# Altium project Carrier-Board-v1.0.PrjPcb (part 3 of 15)

## Sheet LINEAR_VOLTAGE_REG.SchDoc
size A4; SheetNumber: 5; SheetTotal: 27
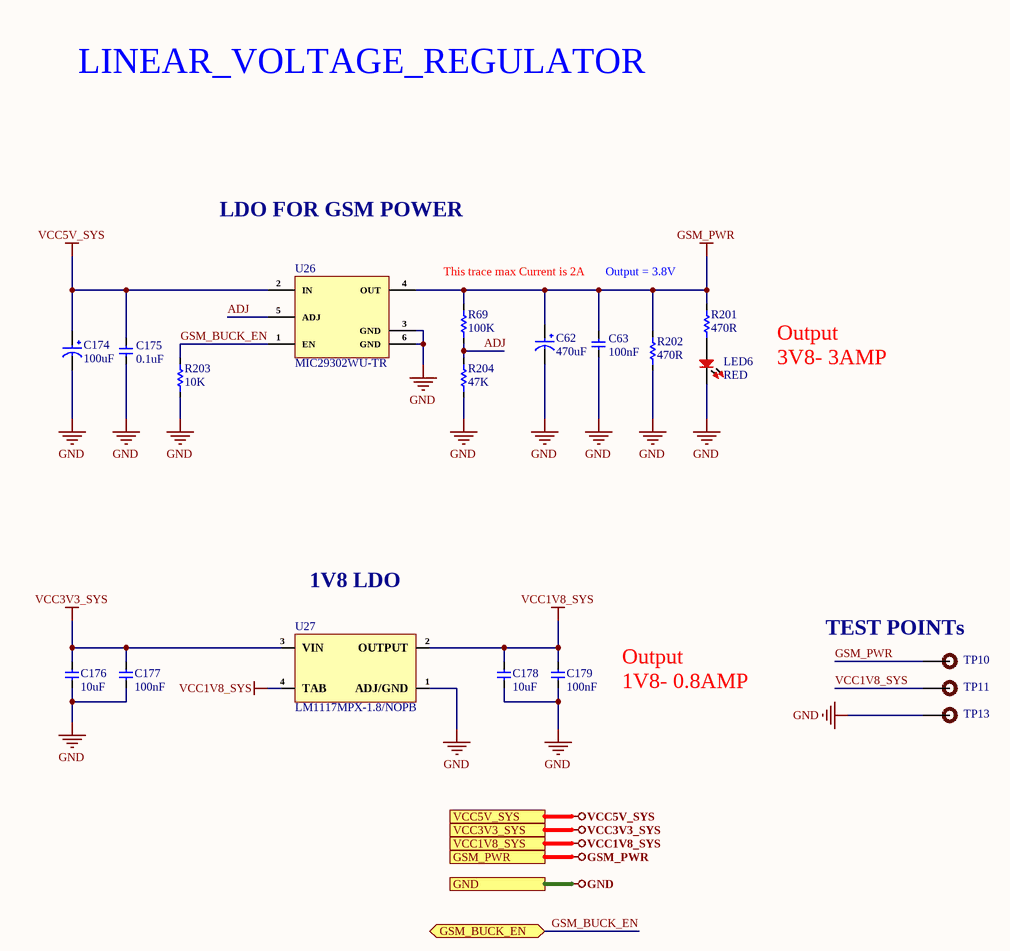
[diagram p4: LINEAR_VOLTAGE_REG.SchDoc]

### Parts
C62  470uF  [Case-E]
C63  100nF  [Cap-0603]
C174  100uF  [Case-B]
C175  0.1uF  [Cap-0603]
C176  10uF  [Cap-0805]
C177  100nF  [cap-0402]
C178  10uF  [Cap-0805]
C179  100nF  [cap-0402]
LED6  RED  [LED-0603]
R69  100K  [Res-0402]
R201  470R  [Res-0603]
R202  470R  [Res-0603]
R203  10K  [Res-0402]
R204  47K  [Res-0402]
TP10  TEST POINT 0.5mm Dia  [Test-point - 0.5mm]  (value not drawn)  (no BOM)
TP11  TEST POINT 0.5mm Dia  [Test-point - 0.5mm]  (value not drawn)  (no BOM)
TP13  TEST POINT 0.5mm Dia  [Test-point - 0.5mm]  (value not drawn)  (no BOM)
U26  MIC29302WU-TR  [TO-263-5 (D2PAK)]
U27  LM1117MPX-1.8/NOPB  [SOT- 223]

### Ports
GND (see POWER SECTION[3B], AUDIO_INTERFACE[1D], BUCK REGULATOR[3D], DEBUG_UART_INTERFACE[3D], DIGITAL IO_RELAY_SHEET[5D], DUAL_SIM_INTERFACE[3D], ETHERNET_PHY0[4D], ETHERNET_PHY1[4D], GSM_INTERFACE[2D], HDMI_INTERFACE[3D], INPUT_PROTECTION[3D], MICRO_SD_INTERFACE[3D], MIPI-DSI DISPLAY[3D], POWER SECTION[3D], PUSH BUTTONs_INTERFACE[3C], RGB_LEDs_INTERFACE[3D], ROCKCHIP_PWR_SUPPLY[1D], ROCKCHIP_SYSTEM_CONTROL[3C], RS232_RS485_INTERFACE[3C], SENSOR_SHEET[3D], USB2.0_INTERFACE[3D], USB3.0_INTERFACE[3D], USB-C_INTERFACE[2D], WIEGAND_INTERFACE[3D], WIFI_BLUETOOTH_SHEET[4C]), GSM_BUCK_EN (bidir, see POWER SECTION[3B], POWER SECTION[3D], ROCKCHIP_GPIO_NC PINS[3D]), GSM_PWR (see POWER SECTION[3B], GSM_INTERFACE[2D], POWER SECTION[3D]), VCC1V8_SYS (see POWER SECTION[3B], ETHERNET_PHY0[4D], ETHERNET_PHY1[4D], POWER SECTION[3D], ROCKCHIP_PWR_SUPPLY[1D], WIFI_BLUETOOTH_SHEET[4C]), VCC3V3_SYS (see POWER SECTION[3B], AUDIO_INTERFACE[1D], BUCK REGULATOR[3D], DEBUG_UART_INTERFACE[3D], DIGITAL IO_RELAY_SHEET[5D], ETHERNET_PHY0[4D], ETHERNET_PHY1[4D], GSM_INTERFACE[2D], HDMI_INTERFACE[3D], MIPI-DSI DISPLAY[3D], POWER SECTION[3D], PUSH BUTTONs_INTERFACE[3C], ROCKCHIP_PWR_SUPPLY[1D], ROCKCHIP_SYSTEM_CONTROL[3C], RS232_RS485_INTERFACE[3C], SENSOR_SHEET[3D], USB-C_INTERFACE[2D], WIEGAND_INTERFACE[3D], WIFI_BLUETOOTH_SHEET[4C]), VCC5V_SYS (see POWER SECTION[3B], BUCK REGULATOR[3D], DIGITAL IO_RELAY_SHEET[5D], HDMI_INTERFACE[3D], MIPI-DSI DISPLAY[3D], POWER SECTION[3D], RGB_LEDs_INTERFACE[3D], ROCKCHIP_PWR_SUPPLY[1D], USB2.0_INTERFACE[3D], USB3.0_INTERFACE[3D], USB-C_INTERFACE[2D], WIEGAND_INTERFACE[3D])

### Nets
GND: C62.2 C63.1 C174.2 C175.1 C176.1 C177.1 C178.1 C179.1 LED6.2 R202.1 R203.1 R204.1 TP13.1 U26.3(GND) U26.6(GND) U27.1(ADJ/GND) ; port GND
GSM_PWR: C62.1 C63.2 R69.2 R201.2 R202.2 TP10.1 U26.4(OUT) ; port GSM_PWR
VCC1V8_SYS: C178.2 C179.2 TP11.1 U27.2(OUTPUT) U27.4(TAB) ; port VCC1V8_SYS
VCC3V3_SYS: C176.2 C177.2 U27.3(VIN) ; port VCC3V3_SYS
VCC5V_SYS: C174.1 C175.2 U26.2(IN) ; port VCC5V_SYS
ADJ: R69.1 R204.2 U26.5(ADJ)
GSM_BUCK_EN: R203.2 U26.1(EN) ; port GSM_BUCK_EN
NetLED6_1: LED6.1 R201.1

### Notes on the sheet
- LINEAR_VOLTAGE_REGULATOR
- LDO FOR GSM POWER
- (near R69) This trace max Current is 2A
- Output = 3.8V
- 3V8- 3AMP
- Output
- 1V8 LDO
- (near TP10) TEST POINTs
- 1V8- 0.8AMP
- File:
- Title:
- Date:
- Page
- Num:
- Total:
- Drawn By: Huzaifa Ali

### Library data of the parts
C62 = TAJE477K010RNJ: CAP TANT 470UF 10% 10V 2917; Manufacturer: Kyocera AVX; Dielectric Material: Tantalum; ESR (Equivalent Series Resistance): 500mR; Leakage Current: 47uA; Polarity: Polar; Item Type: Capacitor; Supplier 1: Arrow Electronics; Manufacturer Part Number: TAJE477K010RNJ; RoHS: Yes; Category: Tantalum Capacitors; Stock 1: 5; Pricing 1: 1=1.3181 (USD); Mounting Technology: Surface Mount,PCB; Case/Package: 2917; Pins: 2; Case Code (Imperial): 2917; Case Code (Metric): 7343; Min Operating Temperature: -55°C; Max Operating Temperature: 125°C; Value: 470uF; Tolerance: 10%; Packaging: Tape and Reel; Voltage Rating: 10V; Voltage Rating (DC): 10V; Package Quantity: 400; Termination: SMD/SMT; Voltage: 10V; Dissipation Factor: 10%; Features: General Purpose; Series: TAJ; Construction: Flat; Length: 7.3mm; Width: 4.3mm; Height: 4.1mm; Depth: 4.3mm; Lead Pitch: 4.4mm; Radiation Hardening: No; Reach SVHC Compliant: No; Lead Free: Lead Free; RoHS Compliant: Yes; ComponentLink1URL: https://datasheet.ciiva.com/7832/taj-7832508.pdf?src-supplier=Element14; ComponentLink1Description: https://datasheet.ciiva.com/7832/taj-7832508.pdf?src-supplier=Element14; ComponentLink2URL: https://datasheet.ciiva.com/7832/taj-7832507.pdf?src-supplier=Element14; ComponentLink2Description: https://datasheet.ciiva.com/7832/taj-7832507.pdf?src-supplier=Element14; ComponentLink3URL: https://datasheet.ciiva.com/265/taj-265547.pdf?src-supplier=Digi-Key; ComponentLink3Description: https://datasheet.ciiva.com/265/taj-265547.pdf?src-supplier=Digi-Key; ComponentLink4URL: https://datasheet.ciiva.com/265/taj-265546.pdf?src-supplier=Digi-Key; ComponentLink4Description: https://datasheet.ciiva.com/265/taj-265546.pdf?src-supplier=Digi-Key; ComponentLink5URL: https://datasheet.ciiva.com/265/taj-265548.pdf?src-supplier=Digi-Key; ComponentLink5Description: https://datasheet.ciiva.com/265/taj-265548.pdf?src-supplier=Digi-Key; ComponentLink6URL: https://datasheet.ciiva.com/12882/taj-27497-12882504.pdf?src-supplier=Mouser; ComponentLink6Description: https://datasheet.ciiva.com/12882/taj-27497-12882504.pdf?src-supplier=Mouser; ComponentLink7URL: https://datasheet.ciiva.com/14602/70001050-14602312.pdf?src-supplier=Allied+Electronics; ComponentLink7Description: https://datasheet.ciiva.com/14602/70001050-14602312.pdf?src-supplier=Allied+Electronics; ComponentLink8URL: https://datasheet.ciiva.com/14600/70001050-14600301.pdf?src-supplier=Allied+Electronics; ComponentLink8Description: https://datasheet.ciiva.com/14600/70001050-14600301.pdf?src-supplier=Allied+Electronics; ComponentLink9URL: https://datasheet.ciiva.com/11229/taj-11229470.pdf?src-supplier=Avnet; ComponentLink9Description: https://datasheet.ciiva.com/11229/taj-11229470.pdf?src-supplier=Avnet; ComponentLink10URL: https://datasheet.ciiva.com/16330/taj-16330918.pdf?src-supplier=Future+Electronics; ComponentLink10Description: https://datasheet.ciiva.com/16330/taj-16330918.pdf?src-supplier=Future+Electronics; Supplier Part Number 1: TAJE477K010RNJ; LCSC Part Number: C7234
C63 = CC0603KRX5R9BB104: CAP CER 0.1UF 50V X5R 0603; Manufacturer: Yageo; Tolerance: 10%; Item Type: Capacitor; Supplier 1: Digi-Key; Manufacturer Part Number: CC0603KRX5R9BB104; RoHS: Yes; Category: Ceramic Capacitors; Stock 1: 152253; Pricing 1: 1=0.10000, 10=0.05200, 50=0.02820, 100=0.02310, 500=0.01648, 1000=0.01294 (USD); Mount: Surface Mount; Case/Package: 0603; Case Code (Metric): 1608; Case Code (Imperial): 0603; Weight: 7.1E-05oz; Min Operating Temperature: -55°C; Max Operating Temperature: 85°C; Capacitance: 100nF; Packaging: Tape and Reel; Voltage Rating: 50V; Dielectric: X5R; Termination: SMD/SMT; Voltage Rating (DC): 50V; Package Quantity: 4000; Length: 0.063inch; Width: 0.031inch; Thickness: 0.035inch; Lead Free: Lead Free; ComponentLink1URL: http://www.mouser.com/ds/2/447/Yageo_UPY-GP_NP0_16V-to-50V_9-358835.pdf?src-supplier=Mouser; ComponentLink1Description: http://www.mouser.com/ds/2/447/Yageo_UPY-GP_NP0_16V-to-50V_9-358835.pdf?src-supplier=Mouser; ComponentLink2URL: https://www.yageo.com/upload/media/product/productsearch/datasheet/mlcc/UPY-GPHC_X5R_4V-to-50V_26.pdf?src-supplier=Digi-Key; ComponentLink2Description: https://www.yageo.com/upload/media/product/productsearch/datasheet/mlcc/UPY-GPHC_X5R_4V-to-50V_26.pdf?src-supplier=Digi-Key; ComponentLink3URL: http://www.yageo.com/exep/pages/download/literatures/ProductSelectionGuide%202014_Final_2.pdf?src-supplier=Digi-Key; ComponentLink3Description: http://www.yageo.com/exep/pages/download/literatures/ProductSelectionGuide%202014_Final_2.pdf?src-supplier=Digi-Key; Supplier Part Number 1: 311-4046-1-ND; LCSC Part Number: C110022; Halogen Free: Halogen Free
C174 = TAJB107M010RNJ: CAP TANT 100UF 20% 10V 1411; Manufacturer: Kyocera AVX; Dielectric Material: Tantalum; Tolerance: 10%; ESR (Equivalent Series Resistance): 1.4R; Leakage Current: 10uA; Dissipation Factor: 8%; Item Type: Capacitor; Supplier 1: Rs; Manufacturer Part Number: TAJB107M010RNJ; RoHS: Yes; Category: Tantalum Capacitors; Stock 1: 17520; Pricing 1: 2000=0.302 (GBP); Mounting Technology: Surface Mount; Case/Package: 1210; Case Code (Imperial): 1210; Case Code (Metric): 3528; Min Operating Temperature: -55°C; Max Operating Temperature: 125°C; Value: 100uF; Voltage Rating (DC): 10V; Series: TAJ; Construction: Flat; Voltage Rating: 10V; Package Quantity: 2000; Packaging: Tape and Reel; Termination: SMD/SMT; Voltage: 10V; Features: General Purpose; Length: 3.5mm; Width: 2.8mm; Height: 2.1mm; Depth: 2.8mm; Radiation Hardening: No; Lead Free: Lead Free; RoHS Compliant: Yes; Reach SVHC Compliant: No; ComponentLink1URL: https://datasheet.ciiva.com/264/taj-264281.pdf?src-supplier=Digi-Key; ComponentLink1Description: https://datasheet.ciiva.com/264/taj-264281.pdf?src-supplier=Digi-Key; ComponentLink2URL: https://datasheet.ciiva.com/264/taj-264280.pdf?src-supplier=Digi-Key; ComponentLink2Description: https://datasheet.ciiva.com/264/taj-264280.pdf?src-supplier=Digi-Key; ComponentLink3URL: https://datasheet.ciiva.com/264/taj-264282.pdf?src-supplier=Digi-Key; ComponentLink3Description: https://datasheet.ciiva.com/264/taj-264282.pdf?src-supplier=Digi-Key; ComponentLink4URL: https://datasheet.ciiva.com/11225/taj-11225964.pdf?src-supplier=Avnet; ComponentLink4Description: https://datasheet.ciiva.com/11225/taj-11225964.pdf?src-supplier=Avnet; ComponentLink5URL: https://datasheet.ciiva.com/11225/taj-11225963.pdf?src-supplier=Avnet; ComponentLink5Description: https://datasheet.ciiva.com/11225/taj-11225963.pdf?src-supplier=Avnet; Supplier Part Number 1: 1354069; LCSC Part Number: C7196
C175 = CC0603KRX7R0BB104: CAP CER 0.1UF 100V X7R 0603; Manufacturer: Yageo; Capacitance: 100nF; Tolerance: 10%; Item Type: Capacitor; Supplier 1: Digi-Key; Manufacturer Part Number: CC0603KRX7R0BB104; RoHS: Yes; Category: Ceramic Capacitors; Stock 1: 60476; Pricing 1: 1=0.19000, 10=0.13500, 50=0.07680, 100=0.06370, 500=0.04466, 1000=0.03696 (USD); Mount: Surface Mount; Case/Package: 0603; Case Code (Metric): 1608; Case Code (Imperial): 0603; Weight: 7.1E-05oz; Min Operating Temperature: -55°C; Max Operating Temperature: 125°C; Package Quantity: 4000; Voltage Rating: 100V; Packaging: Tape and Reel; Dielectric: X7R; Termination: SMD/SMT; Resistor Type: Ceramic; Voltage Rating (DC): 100V; Series: CC; Length: 0.063inch; Width: 0.031inch; Thickness: 0.035inch; Depth: 0.8mm; Lead Free: Lead Free; RoHS Compliant: Yes; ComponentLink1URL: https://datasheet.ciiva.com/6277/mlccorderingcode-6277030.pdf?src-supplier=Digi-Key; ComponentLink1Description: https://datasheet.ciiva.com/6277/mlccorderingcode-6277030.pdf?src-supplier=Digi-Key; ComponentLink2URL: https://datasheet.ciiva.com/6277/mlccorderingcode-6277081.pdf?src-supplier=Digi-Key; ComponentLink2Description: https://datasheet.ciiva.com/6277/mlccorderingcode-6277081.pdf?src-supplier=Digi-Key; ComponentLink3URL: https://datasheet.ciiva.com/6277/mlccorderingcode-6277082.pdf?src-supplier=Digi-Key; ComponentLink3Description: https://datasheet.ciiva.com/6277/mlccorderingcode-6277082.pdf?src-supplier=Digi-Key; Supplier Part Number 1: 311-1523-1-ND; LCSC Part Number: C113803
C176 C178 = GRM21BR61H106ME43L: CAP CER 10UF 50V X5R 0805; Manufacturer: Murata; Supplier 1: Digi-Key; Manufacturer Part Number: GRM21BR61H106ME43L; RoHS: Yes; Category: Ceramic Capacitors; Stock 1: 26; Pricing 1: 1=0.44000, 10=0.30700, 50=0.21500, 100=0.18420, 500=0.13818, 1000=0.11668 (USD); Supplier Part Number 1: 490-18664-1-ND; LCSC Part Number: C2190942
C177 C179 = C1005X7R1H104KT000F: CAP CER 0.1UF 50V X7R 0402; Manufacturer: TDK; Tolerance: 10%; Voltage: 25V; Item Type: Capacitor; Supplier 1: Avnet; Manufacturer Part Number: C1005X7R1H104KT000F; RoHS: No; Category: Ceramic Capacitors; Dielectric: X7R; Supplier Part Number 1: C1005X7R1H104KT000F; LCSC Part Number: C361198; ComponentLink1Description: LCSC; ComponentLink1URL: https://www.lcsc.com/product-detail/Multilayer-Ceramic-Capacitors-MLCC-SMD-SMT_TDK-C1005X7R1H104KT000F_C361198.html
LED6 = NCD0603R3: RED LED 0603 Light Emitting Diodes; Manufacturer: Foshan NationStar Optoelectronics; Manufacturer Part Number: NCD0603R3; Package: 0603; Item Type: LED; LCSC Part Number: C3151730; ComponentLink1Description: LCSC; ComponentLink1URL: https://www.lcsc.com/product-detail/Light-Emitting-Diodes-LED_Foshan-NationStar-Optoelectronics-NCD0603R3_C3151730.html
R69 = RC0402FR-07100KL: RES 100K OHM 1% 1/16W 0402; Manufacturer: Yageo; Resistance: 100kR; Temperature Coefficient: 100ppm/°C; Power Rating: 63mW; Voltage Rating: 50V; Item Type: Resistor; Supplier 1: Mouser; Manufacturer Part Number: RC0402FR-07100KL; RoHS: Yes; Category: Chip SMD Resistors; Stock 1: 7759549; Pricing 1: 1=0.10000, 10=0.01200, 50=0.01200, 100=0.00500, 1000=0.00300, 2500=0.00200, 10000=0.00100 (USD); Case/Package: 0402; Case Code (Metric): 1005; Case Code (Imperial): 0402; Min Operating Temperature: -55°C; Max Operating Temperature: 155°C; Resistor Type: Thick Film; Tolerance: 1%; Packaging: Tape and Reel; Package Quantity: 1; Number of Terminations: 2; Termination: SMD/SMT; Max Power Dissipation: 63mW; Working Voltage: 50V; Features: Moisture Resistant; Series: RC; Resistance Tolerance: 1%; Construction: Rectangular; Technology: THICK FILM; Length: 0.039inch; Width: 0.02inch; Height: 0.016inch; Depth: 0.5mm; REACH SVHC: No SVHC; Lead Free: Lead Free; RoHS Compliant: Yes; Military Standard: Not; ComponentLink1URL: https://datasheet.ciiva.com/11819/0900766b80c66297-11819452.pdf?src-supplier=RSComponents; ComponentLink1Description: https://datasheet.ciiva.com/11819/0900766b80c66297-11819452.pdf?src-supplier=RSComponents; ComponentLink2URL: https://datasheet.ciiva.com/22747/1018594-22747509.pdf?src-supplier=Element14; ComponentLink2Description: https://datasheet.ciiva.com/22747/1018594-22747509.pdf?src-supplier=Element14; ComponentLink3URL: https://datasheet.ciiva.com/2453/pyu-r-int-thick-7-2453362.pdf?src-supplier=Digi-Key; ComponentLink3Description: https://datasheet.ciiva.com/2453/pyu-r-int-thick-7-2453362.pdf?src-supplier=Digi-Key; ComponentLink4URL: https://datasheet.ciiva.com/2453/pyu-r-int-thick-7-2453363.pdf?src-supplier=Digi-Key; ComponentLink4Description: https://datasheet.ciiva.com/2453/pyu-r-int-thick-7-2453363.pdf?src-supplier=Digi-Key; ComponentLink5URL: https://datasheet.ciiva.com/2453/pyu-r-int-thick-7-2453361.pdf?src-supplier=Digi-Key; ComponentLink5Description: https://datasheet.ciiva.com/2453/pyu-r-int-thick-7-2453361.pdf?src-supplier=Digi-Key; ComponentLink6URL: https://datasheet.ciiva.com/12667/pyu-rc0402-51-rohs-l-6-r-12667930.pdf?src-supplier=Mouser; ComponentLink6Description: https://datasheet.ciiva.com/12667/pyu-rc0402-51-rohs-l-6-r-12667930.pdf?src-supplier=Mouser; ComponentLink7URL: https://datasheet.ciiva.com/15189/getdatasheetpartid-323696-15189334.pdf?src-supplier=Verical; ComponentLink7Description: https://datasheet.ciiva.com/15189/getdatasheetpartid-323696-15189334.pdf?src-supplier=Verical; Supplier Part Number 1: 603-RC0402FR-07100KL; LCSC Part Number: C60491
R201 R202 = RC0603FR-07470RL: RES 470 OHM 1% 1/10W 0603; Manufacturer: Yageo; Power Rating: 100mW; Voltage Rating: 50V; Temperature Coefficient: 100ppm/°C; Working Voltage: 75V; Manufacturer Part Number: RC0603FR-07470RL; LCSC Part Number: C114669; ComponentLink1Description: https://datasheet.ciiva.com/11808/0900766b80f96399-11808177.pdf?src-supplier=RSComponents; ComponentLink1URL: https://datasheet.ciiva.com/11808/0900766b80f96399-11808177.pdf?src-supplier=RSComponents; Supplier 1: Digi-Key; RoHS: Yes; Category: Chip SMD Resistors; Stock 1: 154083; Pricing 1: 1=0.10000, 10=0.02400, 100=0.00970, 1000=0.00436, 2500=0.00378 (USD); Case/Package: 0603; Case Code (Metric): 1608; Case Code (Imperial): 0603; Min Operating Temperature: -55°C; Max Operating Temperature: 155°C; Tolerance: 1%; Resistance: 470R; Packaging: Tape and Reel; Package Quantity: 1; Resistor Type: Thick Film; Number of Terminations: 2; Termination: SMD/SMT; Max Power Dissipation: 100mW; Features: Moisture Resistant; Series: RC; Technology: THICK FILM; Resistance Tolerance: 1%; Construction: Rectangular; Length: 1.6mm; Width: 0.031inch; Height: 0.022inch; Depth: 0.8mm; RoHS Compliant: Yes; REACH SVHC: No SVHC; Military Standard: Not; Lead Free: Lead Free; ComponentLink2URL: https://datasheet.ciiva.com/7746/1738695-7746359.pdf?src-supplier=Element14; ComponentLink2Description: https://datasheet.ciiva.com/7746/1738695-7746359.pdf?src-supplier=Element14; ComponentLink3URL: https://datasheet.ciiva.com/7746/1738695-7746360.pdf?src-supplier=Element14; ComponentLink3Description: https://datasheet.ciiva.com/7746/1738695-7746360.pdf?src-supplier=Element14; ComponentLink4URL: https://datasheet.ciiva.com/7660/1868787-7660793.pdf?src-supplier=Element14; ComponentLink4Description: https://datasheet.ciiva.com/7660/1868787-7660793.pdf?src-supplier=Element14; ComponentLink5URL: https://datasheet.ciiva.com/46440/1868787-46440907.pdf?src-supplier=Element14; ComponentLink5Description: https://datasheet.ciiva.com/46440/1868787-46440907.pdf?src-supplier=Element14; ComponentLink6URL: https://datasheet.ciiva.com/2454/pyu-r-int-thick-7-2454012.pdf?src-supplier=Digi-Key; ComponentLink6Description: https://datasheet.ciiva.com/2454/pyu-r-int-thick-7-2454012.pdf?src-supplier=Digi-Key; ComponentLink7URL: https://datasheet.ciiva.com/2454/pyu-r-int-thick-7-2454013.pdf?src-supplier=Digi-Key; ComponentLink7Description: https://datasheet.ciiva.com/2454/pyu-r-int-thick-7-2454013.pdf?src-supplier=Digi-Key; ComponentLink8URL: https://datasheet.ciiva.com/2454/pyu-r-int-thick-7-2454014.pdf?src-supplier=Digi-Key; ComponentLink8Description: https://datasheet.ciiva.com/2454/pyu-r-int-thick-7-2454014.pdf?src-supplier=Digi-Key; Supplier Part Number 1: 311-470HRCT-ND
R203 = RC0402FR-0710KL: RES 10K OHM 1% 1/16W 0402; Manufacturer: Yageo; Item Type: Resistor; Resistance: 10kR; Voltage Rating (DC): 50V; Temperature Coefficient: 100ppm/°C; Power Rating: 62.5mW; Max Power Dissipation: 63mW; Manufacturer Part Number: RC0402FR-0710KL; ComponentLink7Description: https://datasheet.ciiva.com/7849/1784430-7849815.pdf?src-supplier=Element14; ComponentLink7URL: https://datasheet.ciiva.com/7849/1784430-7849815.pdf?src-supplier=Element14; LCSC Part Number: C60490; Supplier 1: Mouser; RoHS: Yes; Category: Chip SMD Resistors; Stock 1: 18648329; Pricing 1: 1=0.10000, 10=0.01400, 50=0.01400, 100=0.00500, 1000=0.00300, 10000=0.00200 (USD); Case/Package: 0402; Number of Pins: 2; Case Code (Imperial): 0402; Case Code (Metric): 1005; Min Operating Temperature: -55°C; Max Operating Temperature: 155°C; Resistor Type: Thick Film; Tolerance: 1%; Packaging: Tape and Reel; Voltage Rating: 50V; Termination: SMD/SMT; Working Voltage: 50V; Number of Terminations: 2; Features: Moisture Resistant; Series: RC; Resistance Tolerance: 1%; Construction: Rectangular; Length: 1mm; Width: 0.5mm; Height: 0.32mm; Depth: 0.5mm; Lead Pitch: 0.2mm; REACH SVHC: No SVHC; Lead Free: Lead Free; RoHS Compliant: Yes; Military Standard: Not; ComponentLink1URL: https://datasheet.ciiva.com/7660/38568-7660787.pdf?src-supplier=Element14; ComponentLink1Description: https://datasheet.ciiva.com/7660/38568-7660787.pdf?src-supplier=Element14; ComponentLink2URL: https://datasheet.ciiva.com/7849/1686128-7849814.pdf?src-supplier=Element14; ComponentLink2Description: https://datasheet.ciiva.com/7849/1686128-7849814.pdf?src-supplier=Element14; ComponentLink3URL: https://datasheet.ciiva.com/7983/1018594-7983486.pdf?src-supplier=Element14; ComponentLink3Description: https://datasheet.ciiva.com/7983/1018594-7983486.pdf?src-supplier=Element14; ComponentLink4URL: https://datasheet.ciiva.com/22747/1018594-22747512.pdf?src-supplier=Element14; ComponentLink4Description: https://datasheet.ciiva.com/22747/1018594-22747512.pdf?src-supplier=Element14; ComponentLink5URL: https://datasheet.ciiva.com/12667/pyu-rc0402-51-rohs-l-6-r-12667067.pdf?src-supplier=Mouser; ComponentLink5Description: https://datasheet.ciiva.com/12667/pyu-rc0402-51-rohs-l-6-r-12667067.pdf?src-supplier=Mouser; ComponentLink6URL: https://datasheet.ciiva.com/7849/1784430-7849813.pdf?src-supplier=Element14; ComponentLink6Description: https://datasheet.ciiva.com/7849/1784430-7849813.pdf?src-supplier=Element14; Supplier Part Number 1: 603-RC0402FR-0710KL
R204 = RC0402FR-0747KL: RES 47K OHM 1% 1/16W 0402; Manufacturer: Yageo; Power Rating: 62.5mW; Temperature Coefficient: 100ppm/°C; Voltage Rating: 50V; Resistance: 47kR; Max Power Dissipation: 63mW; Item Type: Resistor; Supplier 1: Avnet; Manufacturer Part Number: RC0402FR-0747KL; RoHS: Yes; Category: Chip SMD Resistors; Stock 1: 680000; Pricing 1: 10000=0.00085, 20000=0.00087, 40000=0.00084, 60000=0.00083, 80000=0.00079, 100000=0.00078, 1000000=0.00076 (USD); Case/Package: 0402; Case Code (Imperial): 0402; Case Code (Metric): 1005; Size Code: 0402; Min Operating Temperature: -55°C; Max Operating Temperature: 155°C; Tolerance: 1%; Series: RC; Packaging: Tape and Reel; Package Quantity: 1; Termination: SMD/SMT; Resistor Type: Thick Film; Number of Terminations: 2; Features: Moisture Resistant; Resistance Tolerance: 1%; Construction: Rectangular; Length: 1mm; Width: 0.02inch; Height: 0.016inch; Depth: 0.5mm; RoHS Compliant: Yes; Military Standard: Not; Lead Free: Lead Free; ComponentLink1URL: https://datasheet.ciiva.com/46412/1018594-46412839.pdf?src-supplier=Element14; ComponentLink1Description: https://datasheet.ciiva.com/46412/1018594-46412839.pdf?src-supplier=Element14; ComponentLink2URL: https://datasheet.ciiva.com/2453/pyu-r-int-thick-7-2453389.pdf?src-supplier=Digi-Key; ComponentLink2Description: https://datasheet.ciiva.com/2453/pyu-r-int-thick-7-2453389.pdf?src-supplier=Digi-Key; ComponentLink3URL: https://datasheet.ciiva.com/2453/pyu-r-int-thick-7-2453390.pdf?src-supplier=Digi-Key; ComponentLink3Description: https://datasheet.ciiva.com/2453/pyu-r-int-thick-7-2453390.pdf?src-supplier=Digi-Key; ComponentLink4URL: https://datasheet.ciiva.com/2453/pyu-r-int-thick-7-2453388.pdf?src-supplier=Digi-Key; ComponentLink4Description: https://datasheet.ciiva.com/2453/pyu-r-int-thick-7-2453388.pdf?src-supplier=Digi-Key; ComponentLink5URL: https://datasheet.ciiva.com/15189/getdatasheetpartid-323748-15189466.pdf?src-supplier=Verical; ComponentLink5Description: https://datasheet.ciiva.com/15189/getdatasheetpartid-323748-15189466.pdf?src-supplier=Verical; ComponentLink6URL: https://datasheet.ciiva.com/16793/pyu-rc0402-51-rohs-l-6-r-16793430.pdf?src-supplier=Future+Electronics; ComponentLink6Description: https://datasheet.ciiva.com/16793/pyu-rc0402-51-rohs-l-6-r-16793430.pdf?src-supplier=Future+Electronics; Supplier Part Number 1: RC0402FR-0747KL; LCSC Part Number: C93943
TP10 TP11 TP13 = TEST POINT 0.5mm Dia: Test Point ON; Item Type: Test Point; Manufacturer Part Number: TEST POINT 0.5mm Dia
U26 = MIC29302WU-TR: IC REG LDO ADJ 3A TO263-5; Manufacturer: Microchip; Output Voltage: 26V; Dropout Voltage: 370mV; Number of Regulators: 1; Min Input Voltage: 2.5V; Min Output Voltage: 1.25V; Max Output Voltage: 25V; Output Type: Adjustable; Output Configuration: Positive; Input Bias Current: 40nA; Reference Voltage: 1.24V; Quiescent Current: 35mA; Accuracy: 1%; Supplier 1: Future Electronics; Manufacturer Part Number: MIC29302WU-TR; RoHS: Yes; Category: Voltage Regulators - Linear; Pricing 1: 750=2.12000, 1500=2.09000, 2250=2.07000, 3000=2.06000, 3750=2.02000 (USD); Mount: Surface Mount; Case/Package: TO-263; Number of Pins: 5; Min Operating Temperature: -40°C; Max Operating Temperature: 125°C; Packaging: Tape and Reel; Package Quantity: 750; Series: -; Output Current: 3A; Max Input Voltage: 26V; Polarity: Positive; Number of Outputs: 1; Max Output Current: 3A; Length: 10.67mm; Width: 9.17mm; Height: 4.59mm; Radiation Hardening: No; Reach SVHC Compliant: Yes; RoHS Compliant: Yes; Lead Free: Lead Free; ComponentLink1URL: https://datasheet.ciiva.com/23772/1572633-23772885.pdf?src-supplier=Newark; ComponentLink1Description: https://datasheet.ciiva.com/23772/1572633-23772885.pdf?src-supplier=Newark; ComponentLink2URL: https://datasheet.ciiva.com/16296/mic29150-16296190.pdf?src-supplier=Future+Electronics; ComponentLink2Description: https://datasheet.ciiva.com/16296/mic29150-16296190.pdf?src-supplier=Future+Electronics; ComponentLink3URL: https://datasheet.ciiva.com/15200/getdatasheetpartid-143209-15200663.pdf?src-supplier=Verical; ComponentLink3Description: https://datasheet.ciiva.com/15200/getdatasheetpartid-143209-15200663.pdf?src-supplier=Verical; Supplier Part Number 1: 3153683; LCSC Part Number: C11149; Item Type: IC
U27 = LM1117MPX-1.8/NOPB: IC REG LINEAR 1.8V 800MA SOT223; Manufacturer: TI National Semiconductor; Supplier: Mouser; Supplier Part Number: 926-LM1117MPX1.8NOPB; Manufacturer Part Number: LM1117MPX-1.8/NOPB; RoHS: Yes; Category: Voltage Regulators - Linear; Stock: 3721; Pricing: 1=1.35, 10=1.15, 50=1.15, 100=0.878, 1000=0.613, 10000=0.522 (USD); Width: 3.5mm; Thickness: 1.6mm; ComponentLink1URL: https://datasheet.ciiva.com/34302/1282521-34302144.pdf?src-supplier=Jameco; ComponentLink1Description: https://datasheet.ciiva.com/34302/1282521-34302144.pdf?src-supplier=Jameco; ComponentLink2URL: https://datasheet.ciiva.com/46386/1882372-46386047.pdf?src-supplier=Element14; ComponentLink2Description: https://datasheet.ciiva.com/46386/1882372-46386047.pdf?src-supplier=Element14; ComponentLink3URL: https://datasheet.ciiva.com/3223/lm1117-n-3223527.pdf?src-supplier=Avnet; ComponentLink3Description: https://datasheet.ciiva.com/3223/lm1117-n-3223527.pdf?src-supplier=Avnet; ComponentLink4URL: https://datasheet.ciiva.com/6591/lm1117-n-6591863.pdf?src-supplier=Digikey; ComponentLink4Description: https://datasheet.ciiva.com/6591/lm1117-n-6591863.pdf?src-supplier=Digikey; ComponentLink5URL: https://datasheet.ciiva.com/6591/lm1117-n-6591864.pdf?src-supplier=Digikey; ComponentLink5Description: https://datasheet.ciiva.com/6591/lm1117-n-6591864.pdf?src-supplier=Digikey; ComponentLink6URL: https://datasheet.ciiva.com/6591/lm1117-n-6591865.pdf?src-supplier=Digikey; ComponentLink6Description: https://datasheet.ciiva.com/6591/lm1117-n-6591865.pdf?src-supplier=Digikey; LCSC Part Number: C9660; Item Type: IC

## Sheet ROCKCHIP_PWR_SUPPLY.SchDoc
size A4; SheetNumber: 6; SheetTotal: 27
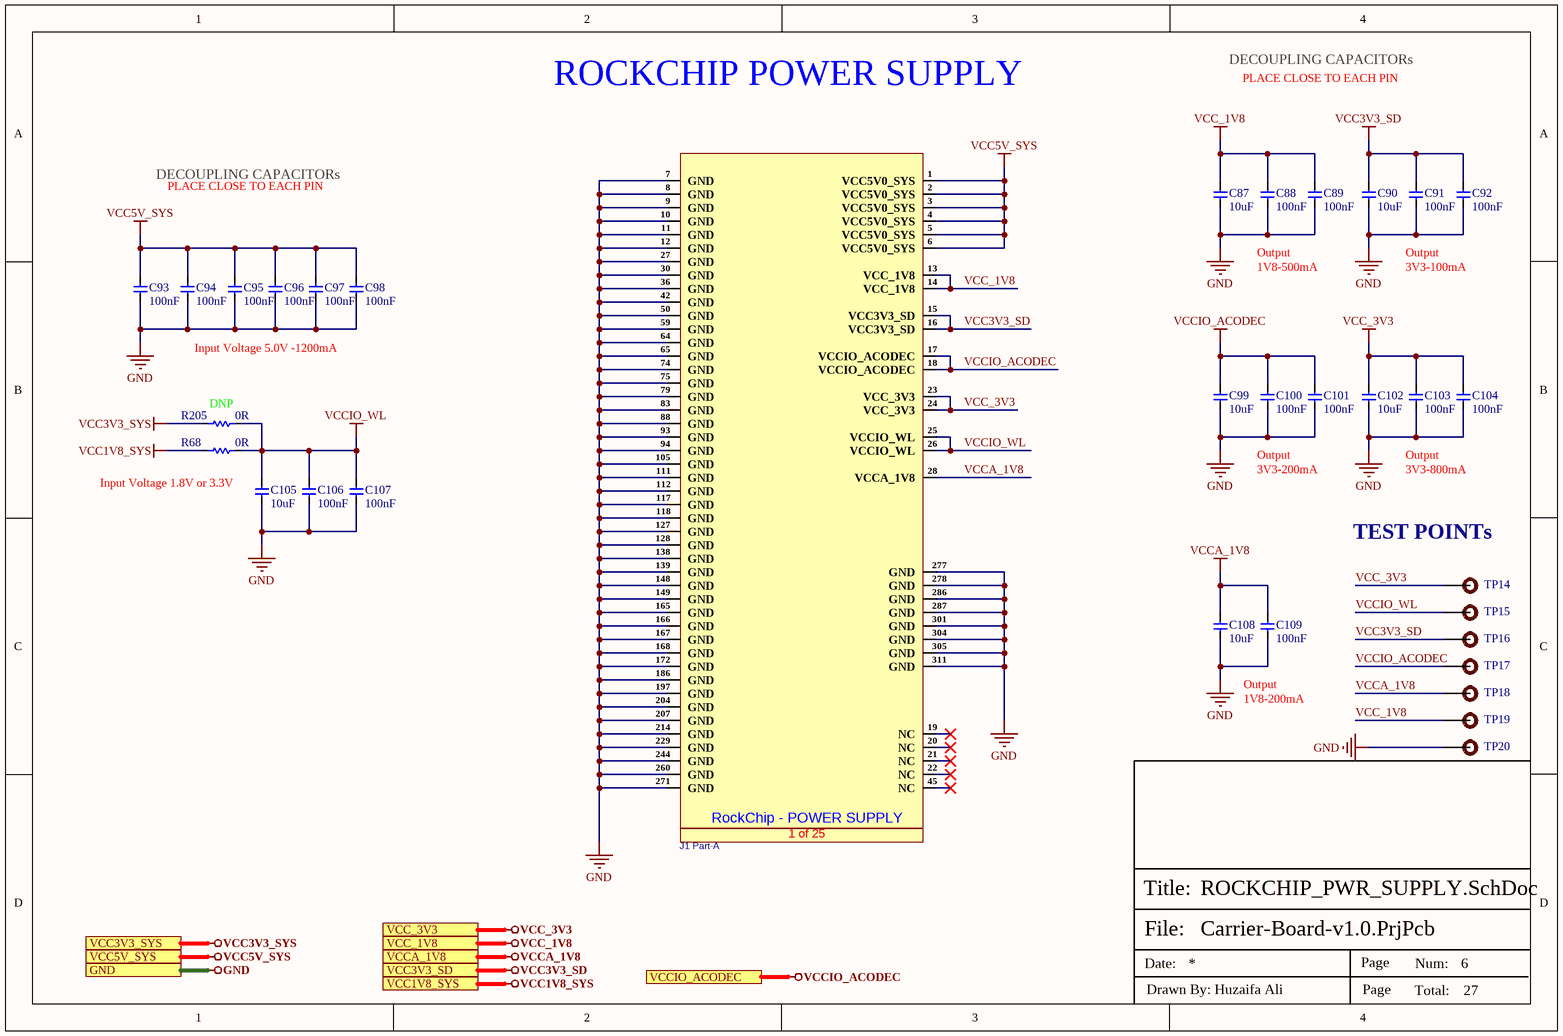
[diagram p5: ROCKCHIP_PWR_SUPPLY.SchDoc]

### Parts
C87  10uF  [Cap-0603]
C88  100nF  [Cap-0402]
C89  100nF  [Cap-0402]
C90  10uF  [Cap-0603]
C91  100nF  [Cap-0402]
C92  100nF  [Cap-0402]
C93  100nF  [Cap-0402]
C94  100nF  [Cap-0402]
C95  100nF  [Cap-0402]
C96  100nF  [Cap-0402]
C97  100nF  [Cap-0402]
C98  100nF  [Cap-0402]
C99  10uF  [Cap-0603]
C100  100nF  [Cap-0402]
C101  100nF  [Cap-0402]
C102  10uF  [Cap-0603]
C103  100nF  [Cap-0402]
C104  100nF  [Cap-0402]
C105  10uF  [Cap-0603]
C106  100nF  [Cap-0402]
C107  100nF  [Cap-0402]
C108  10uF  [Cap-0603]
C109  100nF  [Cap-0402]
J1_Part-  AS0B826-S78B-7H  [AS0B826-S78B-7H]  (value not drawn)  (part A of 25)
R68  0R  [Res-0402]
R205  DNP  [Res-0402]
TP14  TEST POINT 0.5mm Dia  [Test-point - 0.5mm]  (value not drawn)  (no BOM)
TP15  TEST POINT 0.5mm Dia  [Test-point - 0.5mm]  (value not drawn)  (no BOM)
TP16  TEST POINT 0.5mm Dia  [Test-point - 0.5mm]  (value not drawn)  (no BOM)
TP17  TEST POINT 0.5mm Dia  [Test-point - 0.5mm]  (value not drawn)  (no BOM)
TP18  TEST POINT 0.5mm Dia  [Test-point - 0.5mm]  (value not drawn)  (no BOM)
TP19  TEST POINT 0.5mm Dia  [Test-point - 0.5mm]  (value not drawn)  (no BOM)
TP20  TEST POINT 0.5mm Dia  [Test-point - 0.5mm]  (value not drawn)  (no BOM)

### Ports
GND (see TOP SHEET[4B], AUDIO_INTERFACE[1D], BUCK REGULATOR[3D], DEBUG_UART_INTERFACE[3D], DIGITAL IO_RELAY_SHEET[5D], DUAL_SIM_INTERFACE[3D], ETHERNET_PHY0[4D], ETHERNET_PHY1[4D], GSM_INTERFACE[2D], HDMI_INTERFACE[3D], INPUT_PROTECTION[3D], LINEAR_VOLTAGE_REG[3D], MICRO_SD_INTERFACE[3D], MIPI-DSI DISPLAY[3D], POWER SECTION[3D], PUSH BUTTONs_INTERFACE[3C], RGB_LEDs_INTERFACE[3D], ROCKCHIP_SYSTEM_CONTROL[3C], RS232_RS485_INTERFACE[3C], SENSOR_SHEET[3D], USB2.0_INTERFACE[3D], USB3.0_INTERFACE[3D], USB-C_INTERFACE[2D], WIEGAND_INTERFACE[3D], WIFI_BLUETOOTH_SHEET[4C]), VCC1V8_SYS (see TOP SHEET[3A], ETHERNET_PHY0[4D], ETHERNET_PHY1[4D], LINEAR_VOLTAGE_REG[3D], POWER SECTION[3D], WIFI_BLUETOOTH_SHEET[4C]), VCC3V3_SD (see TOP SHEET[4A], MICRO_SD_INTERFACE[3D]), VCC3V3_SYS (see TOP SHEET[3A], AUDIO_INTERFACE[1D], BUCK REGULATOR[3D], DEBUG_UART_INTERFACE[3D], DIGITAL IO_RELAY_SHEET[5D], ETHERNET_PHY0[4D], ETHERNET_PHY1[4D], GSM_INTERFACE[2D], HDMI_INTERFACE[3D], LINEAR_VOLTAGE_REG[3D], MIPI-DSI DISPLAY[3D], POWER SECTION[3D], PUSH BUTTONs_INTERFACE[3C], ROCKCHIP_SYSTEM_CONTROL[3C], RS232_RS485_INTERFACE[3C], SENSOR_SHEET[3D], USB-C_INTERFACE[2D], WIEGAND_INTERFACE[3D], WIFI_BLUETOOTH_SHEET[4C]), VCC5V_SYS (see TOP SHEET[3A], BUCK REGULATOR[3D], DIGITAL IO_RELAY_SHEET[5D], HDMI_INTERFACE[3D], LINEAR_VOLTAGE_REG[3D], MIPI-DSI DISPLAY[3D], POWER SECTION[3D], RGB_LEDs_INTERFACE[3D], USB2.0_INTERFACE[3D], USB3.0_INTERFACE[3D], USB-C_INTERFACE[2D], WIEGAND_INTERFACE[3D]), VCC_1V8 (see TOP SHEET[4A]), VCC_3V3 (see TOP SHEET[4A]), VCCA_1V8 (see TOP SHEET[4A], PUSH BUTTONs_INTERFACE[3C], ROCKCHIP_SYSTEM_CONTROL[3C]), VCCIO_ACODEC (see TOP SHEET[4A], AUDIO_INTERFACE[1D])

### Nets
GND: C87.1 C88.1 C89.1 C90.1 C91.1 C92.1 C93.1 C94.1 C95.1 C96.1 C97.1 C98.1 C99.1 C100.1 C101.1 C102.1 C103.1 C104.1 C105.1 C106.1 C107.1 C108.1 C109.1 J1_Part-.7(GND) J1_Part-.8(GND) J1_Part-.9(GND) J1_Part-.10(GND) J1_Part-.11(GND) J1_Part-.12(GND) J1_Part-.27(GND) J1_Part-.30(GND) J1_Part-.36(GND) J1_Part-.42(GND) J1_Part-.50(GND) J1_Part-.59(GND) J1_Part-.64(GND) J1_Part-.65(GND) J1_Part-.74(GND) J1_Part-.75(GND) J1_Part-.79(GND) J1_Part-.83(GND) J1_Part-.88(GND) J1_Part-.93(GND) J1_Part-.94(GND) J1_Part-.105(GND) J1_Part-.111(GND) J1_Part-.112(GND) J1_Part-.117(GND) J1_Part-.118(GND) J1_Part-.127(GND) J1_Part-.128(GND) J1_Part-.138(GND) J1_Part-.139(GND) J1_Part-.148(GND) J1_Part-.149(GND) J1_Part-.165(GND) J1_Part-.166(GND) J1_Part-.167(GND) J1_Part-.168(GND) J1_Part-.172(GND) J1_Part-.186(GND) J1_Part-.197(GND) J1_Part-.204(GND) J1_Part-.207(GND) J1_Part-.214(GND) J1_Part-.229(GND) J1_Part-.244(GND) J1_Part-.260(GND) J1_Part-.271(GND) J1_Part-.277(GND) J1_Part-.278(GND) J1_Part-.286(GND) J1_Part-.287(GND) J1_Part-.301(GND) J1_Part-.304(GND) J1_Part-.305(GND) J1_Part-.311(GND) TP20.1 ; port GND
VCC1V8_SYS: R68.1 ; port VCC1V8_SYS
VCC3V3_SD: C90.2 C91.2 C92.2 J1_Part-.15(VCC3V3_SD) J1_Part-.16(VCC3V3_SD) TP16.1 ; port VCC3V3_SD
VCC3V3_SYS: R205.1 ; port VCC3V3_SYS
VCC5V_SYS: C93.2 C94.2 C95.2 C96.2 C97.2 C98.2 J1_Part-.1(VCC5V0_SYS) J1_Part-.2(VCC5V0_SYS) J1_Part-.3(VCC5V0_SYS) J1_Part-.4(VCC5V0_SYS) J1_Part-.5(VCC5V0_SYS) J1_Part-.6(VCC5V0_SYS) ; port VCC5V_SYS
VCC_1V8: C87.2 C88.2 C89.2 J1_Part-.13(VCC_1V8) J1_Part-.14(VCC_1V8) TP19.1 ; port VCC_1V8
VCC_3V3: C102.2 C103.2 C104.2 J1_Part-.23(VCC_3V3) J1_Part-.24(VCC_3V3) TP14.1 ; port VCC_3V3
VCCA_1V8: C108.2 C109.2 J1_Part-.28(VCCA_1V8) TP18.1 ; port VCCA_1V8
VCCIO_ACODEC: C99.2 C100.2 C101.2 J1_Part-.17(VCCIO_ACODEC) J1_Part-.18(VCCIO_ACODEC) TP17.1 ; port VCCIO_ACODEC
VCCIO_WL: C105.2 C106.2 C107.2 J1_Part-.25(VCCIO_WL) J1_Part-.26(VCCIO_WL) R68.2 R205.2 TP15.1

Not connected (* = marked no-connect by the designer): J1_Part- 19(NC)* 20(NC)* 21(NC)* 22(NC)* 45(NC)*

### Notes on the sheet
- ROCKCHIP POWER SUPPLY
- PLACE CLOSE TO EACH PIN
- DECOUPLING CAPACITORs
- 1V8-500mA
- Output
- 3V3-100mA
- Input Voltage 5.0V -1200mA
- (near R205) 0R
- (near C105) Input Voltage 1.8V or 3.3V
- 3V3-200mA
- 3V3-800mA
- (near TP14) TEST POINTs
- 1V8-200mA
- File:
- Title:
- Date:
- Page
- Num:
- Total:
- Drawn By: Huzaifa Ali
- (in symbol AS0B826-S78B-7H, part A) RockChip - POWER SUPPLY; 1 of 25

### Library data of the parts
C87 C90 C99 C102 C105 C108 = C1608X5R1E106M080AC: CAP CER 10UF 25V X5R 0603; Manufacturer: TDK; Tolerance: 20%; Dielectric Material: Ceramic; Item Type: Capacitor; Manufacturer Part Number: C1608X5R1E106M080AC; Supplier 1: Digi-Key; Stock 1: 61681; Pricing 1: 1=0.96, 10=0.704, 100=0.483, 500=0.38238, 1000=0.322 (USD); Mount: Surface Mount; Case/Package: 0603; Case Code (Metric): 1608; Case Code (Imperial): 0603; Min Operating Temperature: -55°C; Max Operating Temperature: 85°C; Capacitance: 10uF; Dielectric: X5R; Packaging: Tape and Reel; Voltage Rating: 25V; Package Quantity: 1; Voltage Rating (DC): 25V; Termination: SMD/SMT; Length: 1.6mm; Width: 0.8mm; Height: 0.8mm; Thickness: 0.039inch; Depth: 0.8mm; REACH SVHC: No SVHC; Lead Free: Lead Free; Supplier Part Number 1: 445-9015-1-ND; LCSC Part Number: C2168289; Weight: 7.1E-05oz; Composition: Ceramic
C88 C89 C91-C98 C100 C101 C103 C104 C106 C107 C109 = CC0402KRX5R7BB104: CAP CER 0.1UF 16V X5R 0402; Manufacturer: Yageo; Tolerance: 10%; Manufacturer Part Number: CC0402KRX5R7BB104; RoHS: Yes; Category: Ceramic Capacitors; Supplier 1: Mouser; Stock 1: 936792; Pricing 1: 1=0.10000, 10=0.02300, 50=0.02300, 100=0.01100, 1000=0.00600, 10000=0.00400 (USD); Mount: Surface Mount; Case/Package: 0402; Number of Pins: 2; Case Code (Metric): 1005; Case Code (Imperial): 0402; Min Operating Temperature: -55°C; Max Operating Temperature: 85°C; Capacitance: 100nF; Dielectric: X5R; Packaging: Tape and Reel; Voltage Rating: 16V; Package Quantity: 1; Voltage Rating (DC): 16V; Termination: SMD/SMT; Resistor Type: Ceramic; Series: CC; Construction: Flat; Length: 1mm; Width: 0.02inch; Height: 0.5mm; Thickness: 0.022inch; Depth: 0.5mm; Radiation Hardening: No; REACH SVHC: Unknown; Lead Free: Lead Free; Halogen Free: Halogen Free; RoHS Compliant: Yes; ComponentLink1URL: https://datasheet.ciiva.com/155/mlccorderingcode-155879.pdf?src-supplier=Digi-Key; ComponentLink1Description: https://datasheet.ciiva.com/155/mlccorderingcode-155879.pdf?src-supplier=Digi-Key; ComponentLink2URL: https://datasheet.ciiva.com/155/mlccorderingcode-155878.pdf?src-supplier=Digi-Key; ComponentLink2Description: https://datasheet.ciiva.com/155/mlccorderingcode-155878.pdf?src-supplier=Digi-Key; ComponentLink3URL: https://datasheet.ciiva.com/155/mlccorderingcode-155880.pdf?src-supplier=Digi-Key; ComponentLink3Description: https://datasheet.ciiva.com/155/mlccorderingcode-155880.pdf?src-supplier=Digi-Key; ComponentLink4URL: https://datasheet.ciiva.com/11464/upy-gphc-x5r-4v-to-50v-12-11464869.pdf?src-supplier=Avnet; ComponentLink4Description: https://datasheet.ciiva.com/11464/upy-gphc-x5r-4v-to-50v-12-11464869.pdf?src-supplier=Avnet; Supplier Part Number 1: 603-CC402KRX5R7BB104; LCSC Part Number: C106204
J1_Part- = AS0B826-S78B-7H: SMD,P=0.5mm,Surface Mount，Right Angle; Manufacturer: FOXCONN; Item Type: Card Edge Connectors; Supplier: LCSC; LCSC Part Number: C426232; Manufacturer Part Number: AS0B826-S78B-7H; RoHS: No; Stock: 4979; Pricing: 1=9.21, 10=8.287, 25=7.8064, 50=7.6064, 100=7.4062 (USD)
R68 = RC0402FR-070RL: RES 0 OHM JUMPER 1/16W 0402; Manufacturer: Yageo; Tolerance: 1%; Power Rating: 62.5mW; Voltage Rating: 50V; Temperature Coefficient: 200ppm/°C; Max Power Dissipation: 63mW; Supplier 1: Mouser; Manufacturer Part Number: RC0402FR-070RL; RoHS: Yes; Category: Chip SMD Resistors; Stock 1: 8556842; Pricing 1: 1=0.10000, 10=0.01400, 50=0.01400, 100=0.00600, 1000=0.00300, 5000=0.00200, 10000=0.00100 (USD); Mount: Surface Mount; Case/Package: 0402; Contact Plating: Tin,Matte; Case Code (Imperial): 0402; Case Code (Metric): 1005; Size Code: 0402; Min Operating Temperature: -55°C; Max Operating Temperature: 155°C; Resistance: 0R; Resistor Type: Thick Film; Packaging: Tape and Reel; Termination: SMD/SMT; Features: Moisture Resistant; Series: RC; Number of Terminations: 2; Length: 1mm; Width: 0.5mm; Height: 0.35mm; Radiation Hardening: No; Lead Free: Lead Free; RoHS Compliant: Yes; ComponentLink1URL: https://datasheet.ciiva.com/8896/pyu-rc0402-51-rohs-l-6-8896149.pdf?src-supplier=Avnet; ComponentLink1Description: https://datasheet.ciiva.com/8896/pyu-rc0402-51-rohs-l-6-8896149.pdf?src-supplier=Avnet; ComponentLink2URL: https://datasheet.ciiva.com/16790/pyu-rc0402-51-rohs-l-6-r-16790444.pdf?src-supplier=Future+Electronics; ComponentLink2Description: https://datasheet.ciiva.com/16790/pyu-rc0402-51-rohs-l-6-r-16790444.pdf?src-supplier=Future+Electronics; Supplier Part Number 1: 603-RC0402FR-070RL; LCSC Part Number: C106231
R205 = RC0402FR-070RL: RES 0 OHM JUMPER 1/16W 0402; Manufacturer: Yageo; Resistance: 0R; Tolerance: 1%; Power Rating: 62.5mW; Voltage Rating: 50V; Temperature Coefficient: 200ppm/°C; Max Power Dissipation: 63mW; Supplier 1: Mouser; Manufacturer Part Number: RC0402FR-070RL; RoHS: Yes; Category: Chip SMD Resistors; Stock 1: 8556842; Pricing 1: 1=0.10000, 10=0.01400, 50=0.01400, 100=0.00600, 1000=0.00300, 5000=0.00200, 10000=0.00100 (USD); Mount: Surface Mount; Case/Package: 0402; Contact Plating: Tin,Matte; Case Code (Imperial): 0402; Case Code (Metric): 1005; Size Code: 0402; Min Operating Temperature: -55°C; Max Operating Temperature: 155°C; Resistor Type: Thick Film; Packaging: Tape and Reel; Termination: SMD/SMT; Features: Moisture Resistant; Series: RC; Number of Terminations: 2; Length: 1mm; Width: 0.5mm; Height: 0.35mm; Radiation Hardening: No; Lead Free: Lead Free; RoHS Compliant: Yes; ComponentLink1URL: https://datasheet.ciiva.com/8896/pyu-rc0402-51-rohs-l-6-8896149.pdf?src-supplier=Avnet; ComponentLink1Description: https://datasheet.ciiva.com/8896/pyu-rc0402-51-rohs-l-6-8896149.pdf?src-supplier=Avnet; ComponentLink2URL: https://datasheet.ciiva.com/16790/pyu-rc0402-51-rohs-l-6-r-16790444.pdf?src-supplier=Future+Electronics; ComponentLink2Description: https://datasheet.ciiva.com/16790/pyu-rc0402-51-rohs-l-6-r-16790444.pdf?src-supplier=Future+Electronics; Supplier Part Number 1: 603-RC0402FR-070RL; LCSC Part Number: C106231
TP14-TP20 = TEST POINT 0.5mm Dia: Test Point ON; Item Type: Test Point; Manufacturer Part Number: TEST POINT 0.5mm Dia